# EAGLE design LightSwitch (EAGLE 6.4)
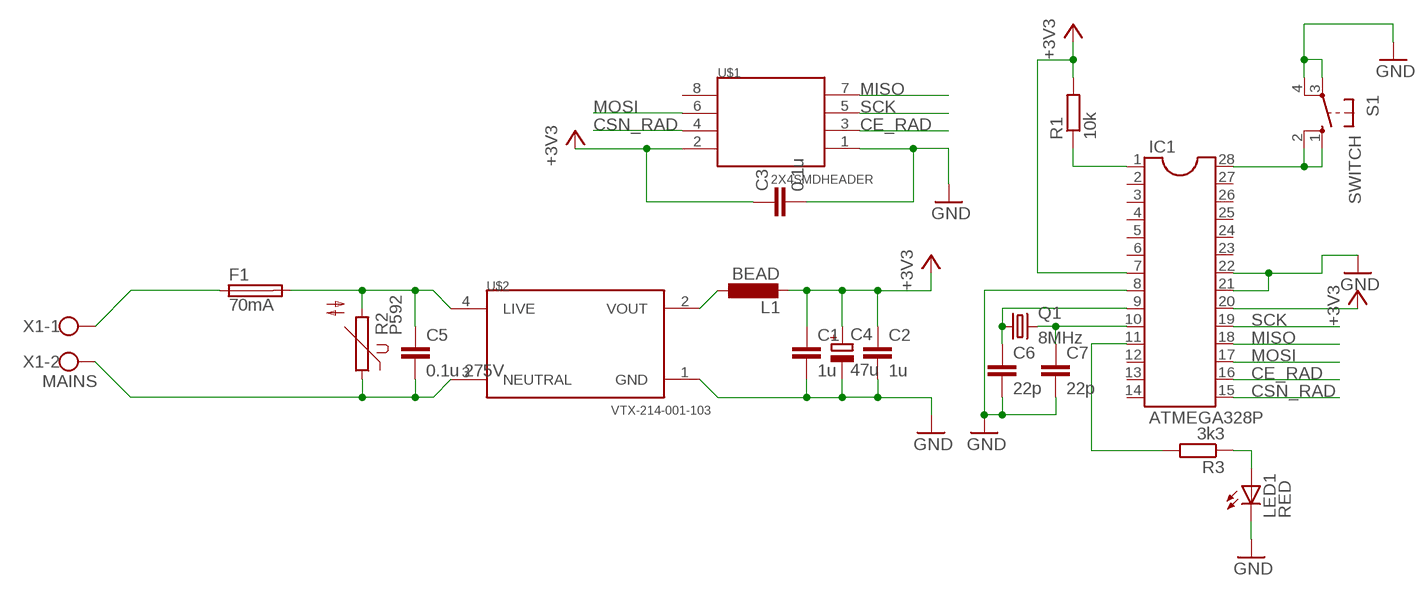
[diagram p0: schematic, sheet 1]

## Parts
C1  1u  C-EU025-025X050  [C025-025X050]
C2  1u  C-EUC1206  [C1206]
C3  0.1u  C-EUC1206  [C1206]
C4  47u  CPOL-EUE2,5-6E  [E2,5-6E]
C5  0.1u 275V  C15/5  [C15B5]
C6  22p  C-EUC1206  [C1206]
C7  22p  C-EUC1206  [C1206]
F1  70mA  SH25  [SH25]
IC1  ATMEGA328P  DIL28-3  [DIL28-3]
L1  BEAD  L-EUL3230M  [L3230M]
LED1  RED  LED5MM  [LED5MM]
Q1  8MHz  CRYSTALHC49U70  [HC49U70]
R1  10k  R-EU_R1206  [R1206]
R2  P592  [P592]
R3  3k3  R-EU_R1206  [R1206]
S1  SWITCH  40-XX  [B3F-40XX]
U$1  2X4SMDHEADER  [TSM-110-XX-XXX-DV]
U$2  VTX-214-001-103  [VTX214001103]
X1  MAINS  W237-102  [W237-102]

## Nets
+3V3: C1.1 C2.1 C3.1 C4.+ IC1.7 IC1.20 L1.2 R1.2 U$1.2
CE_RAD: IC1.16 U$1.3
CSN_RAD: IC1.15 U$1.4
GND: C1.2 C2.2 C3.2 C4.- C6.2 C7.2 IC1.8 IC1.21 IC1.22 LED1.K(C) S1.3(P) S1.4(P1) U$1.1 U$2.1(GND)
MISO: IC1.18 U$1.7
MOSI: IC1.17 U$1.6
N$1: F1.1 X1.1
N$2: C5.1 F1.2 R2.2 U$2.4(LIVE)
N$3: IC1.1 R1.1
N$4: C5.2 R2.1 U$2.3(NEUTRAL) X1.2
N$5: IC1.11 R3.2
N$6: LED1.A R3.1
N$7: IC1.28 S1.1(S) S1.2(S1)
N$8: C6.1 IC1.9 Q1.1
N$9: C7.1 IC1.10 Q1.2
SCK: IC1.19 U$1.5
VOUT: L1.1 U$2.2(VOUT)
Unconnected: IC1.2 IC1.3 IC1.4 IC1.5 IC1.6 IC1.12 IC1.13 IC1.14 IC1.23 IC1.24 IC1.25 IC1.26 IC1.27 U$1.8

## Library data of the parts
C1-C3 C6 C7 = rcl:C-EU: CAPACITOR, European symbol
C4 = rcl:CPOL-EU: POLARIZED CAPACITOR, European symbol
C5 = capacitor-wima:C: CAPACITOR naming: grid - package width
F1 = fuse:SH25: FUSE HOLDER grid 25 mm, OGN0031 8211, Schurter (Buerklin); MF: SCHURTER; MPN: 0031.8211; OC_FARNELL: 1162741; OC_NEWARK: 96B9380
IC1 = ic-package:DIL28: Dual In Line
L1 = rcl:L-EU: INDUCTOR, European symbol
LED1 = led:LED: LED OSRAM: - CHIPLED LG R971, LG N971, LY N971, LG Q971, LY Q971, LO R971, LY R971 LH N974, LH R974 LS Q976, LO Q976, LY Q976 LO Q996 - Hyper CHIPLED LW Q18S LB Q993, LB Q99A, LB R99A - SideLED LS A670, LO A670, LY A670, LG A670, LP A670 LB A673, LV A673, LT A673, LW A673 LH A674 LY A675 LS A676, LA A676, LO A676, LY A676, LW A676 LS A679, LY A679, LG A679 - Hyper Micro SIDELED® LS Y876, LA Y876, LO Y876, LY Y876 LT Y87S - SmartLED LW L88C, LW L88S LB L89C, LB L89S, LG L890 LS L89K, LO L89K, LY L89K LS L896, LA L896, LO L896, LY L896 - TOPLED LS T670, LO T670, LY T670, LG T670, LP T670 LSG T670, LSP T670, LSY T670, LOP T670, LYG T670 LG T671, LOG T671, LSG T671 LB T673, LV T673, LT T673, LW T673 LH T674 LS T676, LA T676, LO T676, LY T676, LB T676, LH T676, LSB T676, LW T676 LB T67C, LV T67C, LT T67C, LS T67K, LO T67K, LY T67K, LW E67C LS E67B, LA E67B, LO E67B, LY E67B, LB E67C, LV E67C, LT E67C LW T67C LS T679, LY T679, LG T679 LS T770, LO T770, LY T770, LG T770, LP T770 LB T773, LV T773, LT T773, LW T773 LH T774 LS E675, LA E675, LY E675, LS T675 LS T776, LA T776, LO T776, LY T776, LB T776 LHGB T686 LT T68C, LB T68C - Hyper Mini TOPLED® LB M676 - Mini TOPLED Santana® LG M470 LS M47K, LO M47K, LY M47K Source: http://www.osram.convergy.de LUXEON: - LUMILED® LXK2-PW12-R00, LXK2-PW12-S00, LXK2-PW14-U00, LXK2-PW14-V00 LXK2-PM12-R00, LXK2-PM12-S00, LXK2-PM14-U00 LXK2-PE12-Q00, LXK2-PE12-R00, LXK2-PE12-S00, LXK2-PE14-T00, LXK2-PE14-U00 LXK2-PB12-K00, LXK2-PB12-L00, LXK2-PB12-M00, LXK2-PB14-N00, LXK2-PB14-P00, LXK2-PB14-Q00 LXK2-PR12-L00, LXK2-PR12-M00, LXK2-PR14-Q00, LXK2-PR14-R00 LXK2-PD12-Q00, LXK2-PD12-R00, LXK2-PD12-S00 LXK2-PH12-R00, LXK2-PH12-S00 LXK2-PL12-P00, LXK2-PL12-Q00, LXK2-PL12-R00 Source: www.luxeon.com KINGBRIGHT: KA-3528ASYC Source: www.kingbright.com
Q1 = crystal:CRYSTAL: CRYSTAL; OC_FARNELL: unknown; OC_NEWARK: unknown
R1 R3 = rcl:R-EU_: RESISTOR, European symbol
R2 = varistor:P592: VARISTOR
S1 = switch-omron:40-XX: OMRON SWITCH; MF: OMRON COMPONENTS USA; MPN: B3F-4000; OC_FARNELL: 176434; OC_NEWARK: 36K3105
U$1 = Header:2X4SMDHEADER
U$2 = VTX214001103:VTX-214-001-103
X1 = con-wago-500:W237-102: WAGO SCREW CLAMP; MPN: 237-102; OC_FARNELL: unknown; OC_NEWARK: 70K9898

## Board
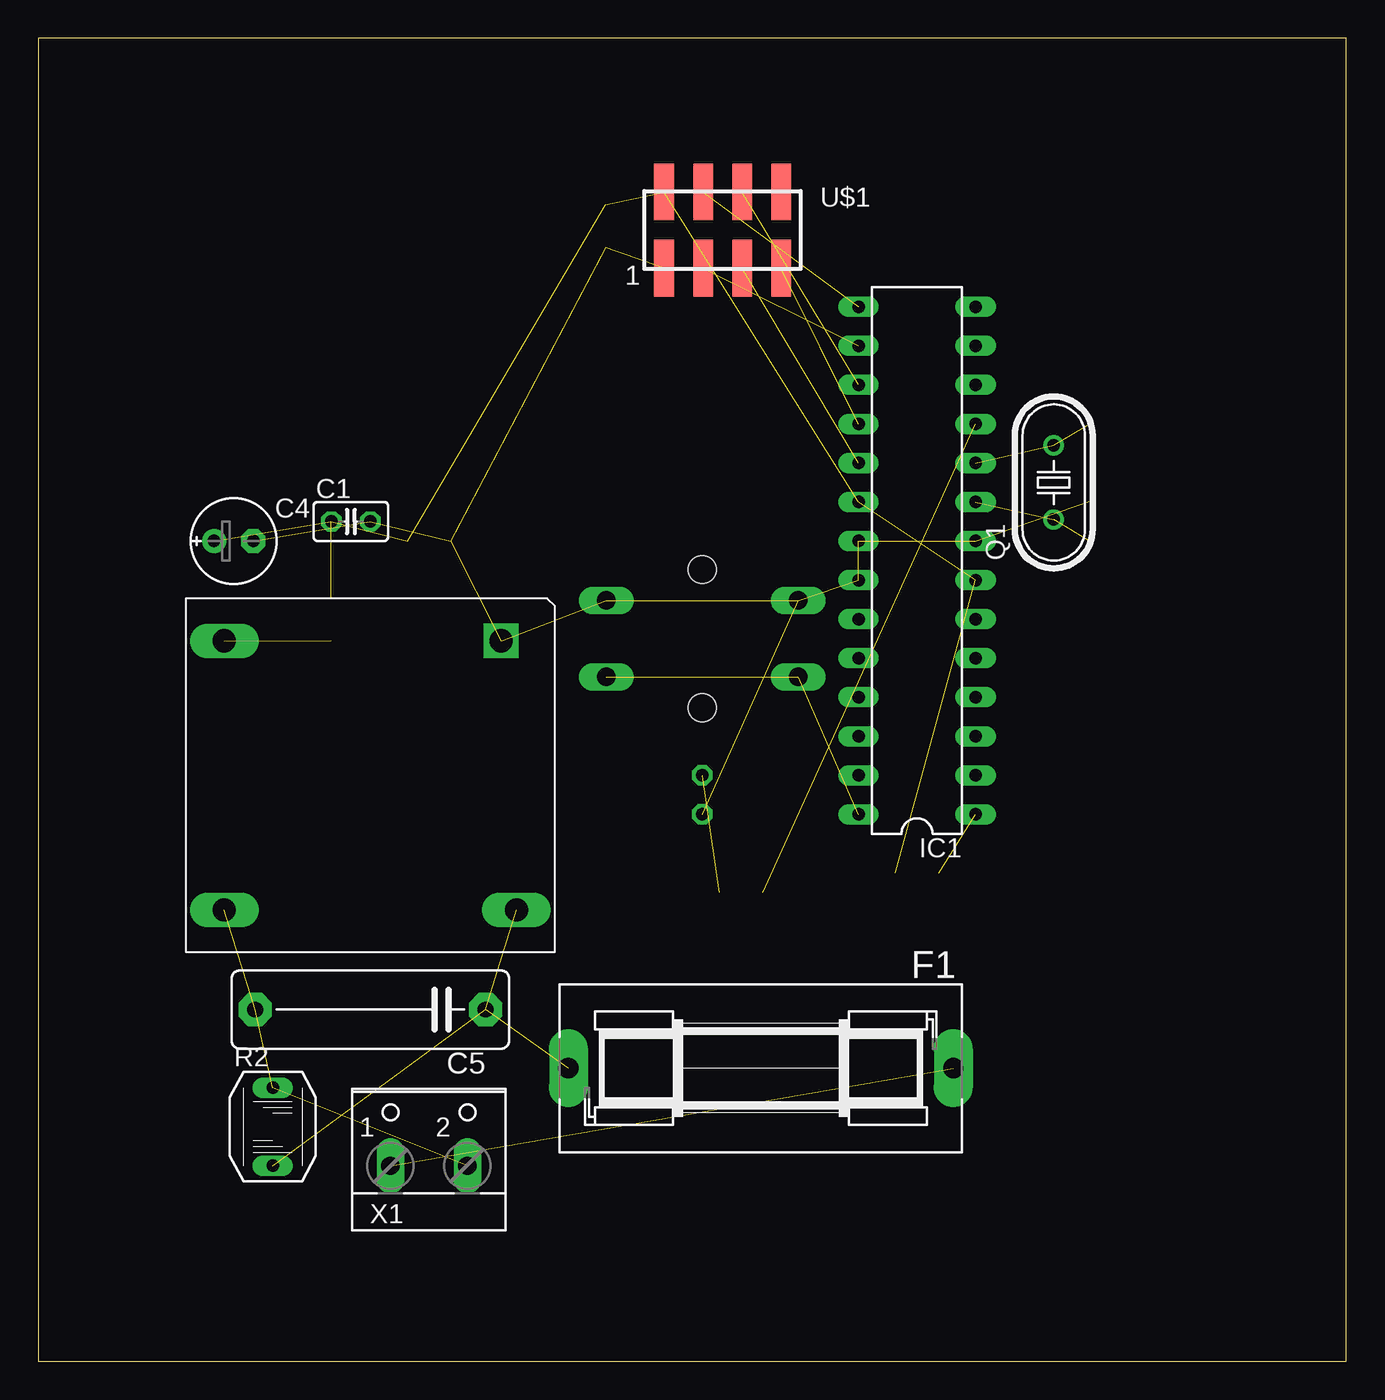
[diagram p1: board, top side]
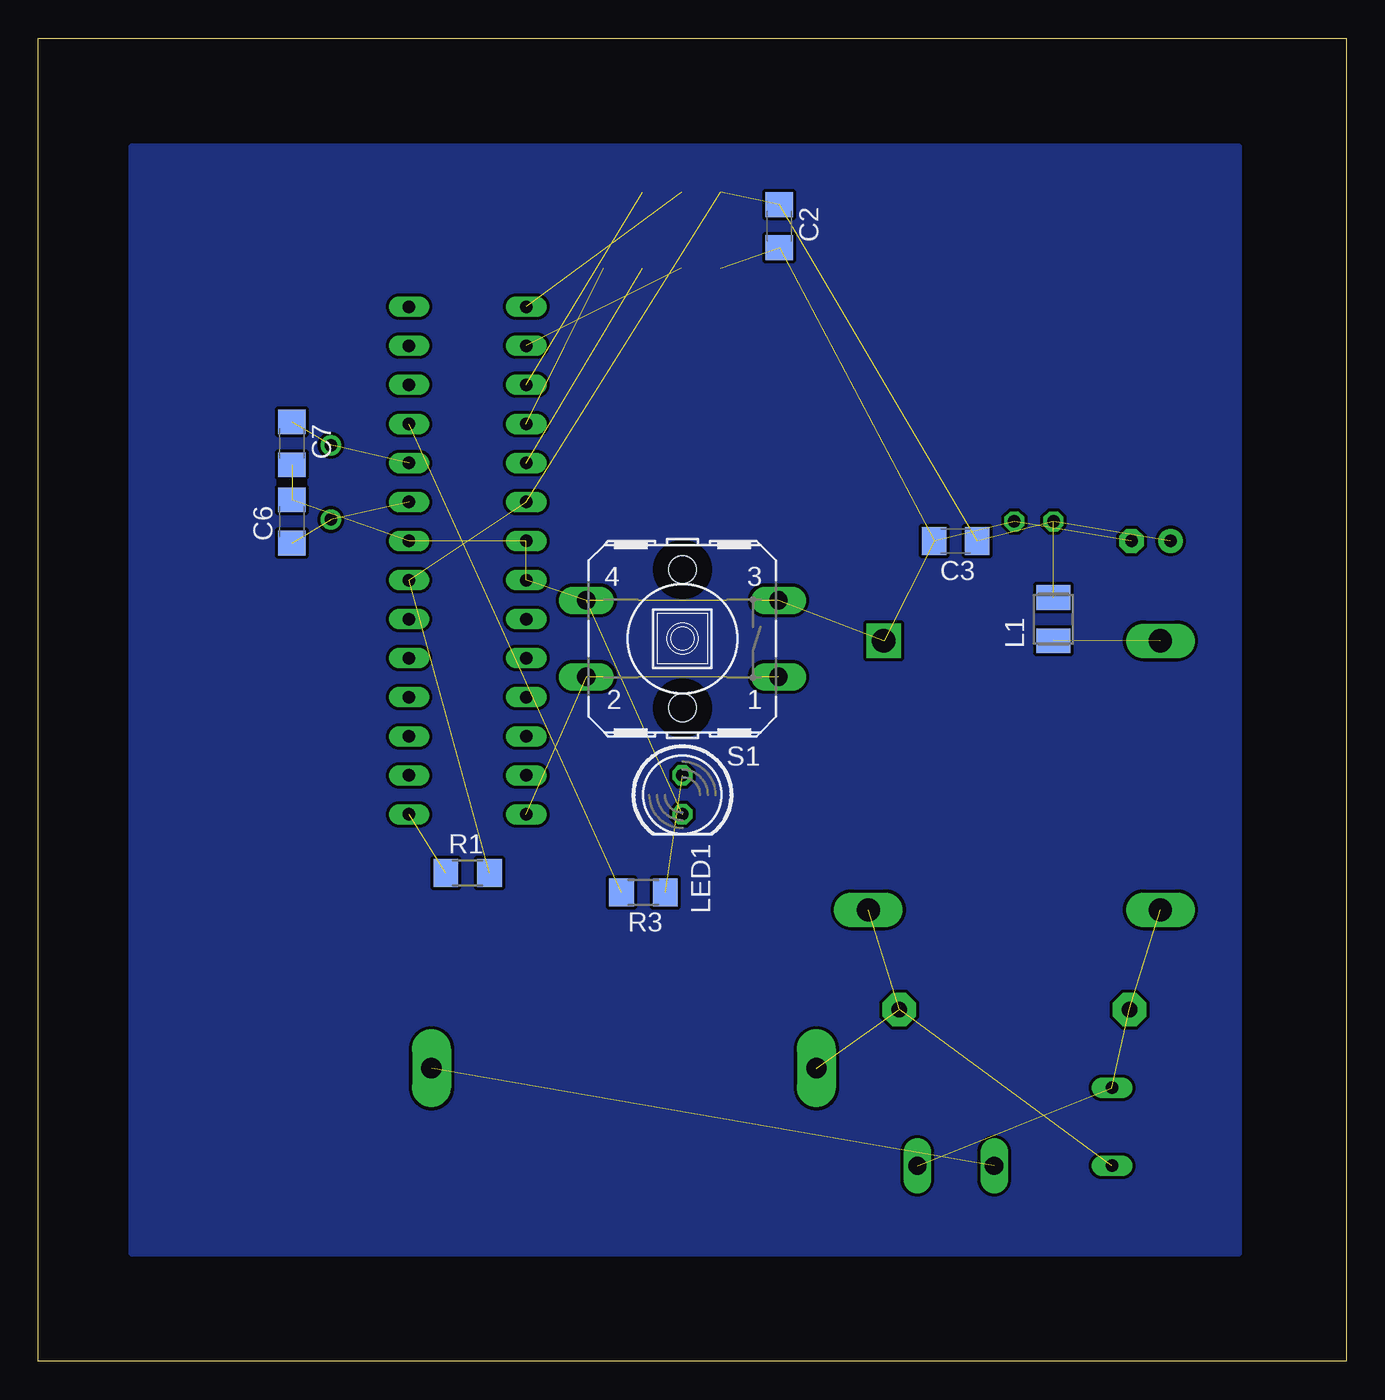
[diagram p2: board, bottom side, seen from below]

Size 85.07 x 86.03 mm. Coordinates in mm from the lower left corner, seen from the top.
Outline: 0,0 85.07,0 85.07,86.03 0,86.03 0,0
Copper layers (1*16): Top 0.035mm / dielectric 1.5mm / Bottom 0.035mm
Design rules "default": minimum track width 10mil, minimum drill 24mil, track to track 8mil, track to pad 8mil, pad to pad 8mil, via to via 8mil, smd to smd 8mil, copper to edge 40mil, drill to drill 8mil, minimum pad ring 10mil, minimum via ring 8mil, stop-mask expansion 4mil, vias tented up to drill 0mil, thermal gap 10mil

### Footprints (pad centres in the part's own frame; a part is rotated, then mirrored left to right if it is on the bottom)
C025-025X050 = drill 0.813 octagon: 1 -1.27,0; 2 1.27,0
C1206 = smd 1.6 x 1.8: 1 -1.4,0; 2 1.4,0
E2,5-6E = drill 0.813 pad 1.575: + -1.27,0 | drill 0.813 pad 1.575 octagon: - 1.27,0
C15B5 = drill 1.016 pad 2.159 octagon: 1 -7.493,0; 2 7.493,0
SH25 = drill 1.321 pad 2.54 long: 1 -12.522,0; 2 12.522,0
DIL28-3 = drill 0.813 long: 1 -16.51,-3.81; 2 -13.97,-3.81; 3 -11.43,-3.81; 4 -8.89,-3.81; 5 -6.35,-3.81; 6 -3.81,-3.81; 7 -1.27,-3.81; 8 1.27,-3.81; 9 3.81,-3.81; 10 6.35,-3.81; 11 8.89,-3.81; 12 11.43,-3.81; 13 13.97,-3.81; 14 16.51,-3.81; 15 16.51,3.81; 16 13.97,3.81; 17 11.43,3.81; 18 8.89,3.81; 19 6.35,3.81; 20 3.81,3.81; 21 1.27,3.81; 22 -1.27,3.81; 23 -3.81,3.81; 24 -6.35,3.81; 25 -8.89,3.81; 26 -11.43,3.81; 27 -13.97,3.81; 28 -16.51,3.81
L3230M = smd 1.6 x 2.2: 1 -1.4,0; 2 1.4,0
LED5MM = drill 0.813 octagon: A -1.27,0; K 1.27,0
HC49U70 = drill 0.813: 1 -2.413,0; 2 2.413,0
R1206 = smd 1.6 x 1.803: 1 -1.422,0; 2 1.422,0
P592 = drill 0.813 long: 1 0,2.54; 2 0,-2.54
B3F-40XX = drill 1.194 long: 1 -6.248,2.489; 2 6.248,2.489; 3 -6.248,-2.489; 4 6.248,-2.489 | hole 1.803: 0,-4.496; 0,4.496
TSM-110-XX-XXX-DV = smd 1.27 x 3.683: 1 -3.81,-2.731; 2 -3.81,2.223; 3 -1.27,-2.731; 4 -1.27,2.223; 5 1.27,-2.731; 6 1.27,2.223; 7 3.81,-2.731; 8 3.81,2.223
VTX214001103 = drill 1.5 square: 1 8.75,-8.5 | drill 1.5 long: 2 8.75,9.5; 3 -8.75,9.5; 4 -8.75,-9.5
W237-102 = drill 1.194 long: 1 -2.5,-1.27; 2 2.5,-1.27

### Placement (x,y rotation side)
C1  20.32,54.61 0 top
C2  36.88,73.82 270 bottom
C3  25.4,53.34 180 bottom
C4  12.7,53.34 0 top
C5  21.59,22.86 180 top
C6  68.58,54.61 90 bottom
C7  68.58,59.69 270 bottom
F1  46.99,19.05 180 top
IC1  57.15,52.07 90 top
L1  19.05,48.26 90 bottom
LED1  43.18,36.83 270 bottom
Q1  66.04,57.15 90 top
R1  57.15,31.75 0 bottom
R2  15.24,15.24 0 top
R3  45.72,30.48 180 bottom
S1  43.18,46.99 180 bottom
U$1  44.5,73.82 0 top
U$2  21.59,38.1 90 top
X1  25.4,13.97 0 top

### Tracks (layer width: path | path; a pad name or v marks a point on that pad's centre or on a via)
+3V3  (8 unrouted)
CE_RAD  (1 unrouted)
CSN_RAD  (1 unrouted)
GND  (13 unrouted)
MISO  (1 unrouted)
MOSI  (1 unrouted)
N$1  (1 unrouted)
N$2  (3 unrouted)
N$3  (1 unrouted)
N$4  (3 unrouted)
N$5  (1 unrouted)
N$6  (1 unrouted)
N$7  (2 unrouted)
N$8  (2 unrouted)
N$9  (2 unrouted)
N$11
  pour Bottom: 7,7 79,7 79,79 7,79
SCK  (1 unrouted)
VOUT  (1 unrouted)